# EAGLE schematic Power_section (EAGLE 7.3.0)
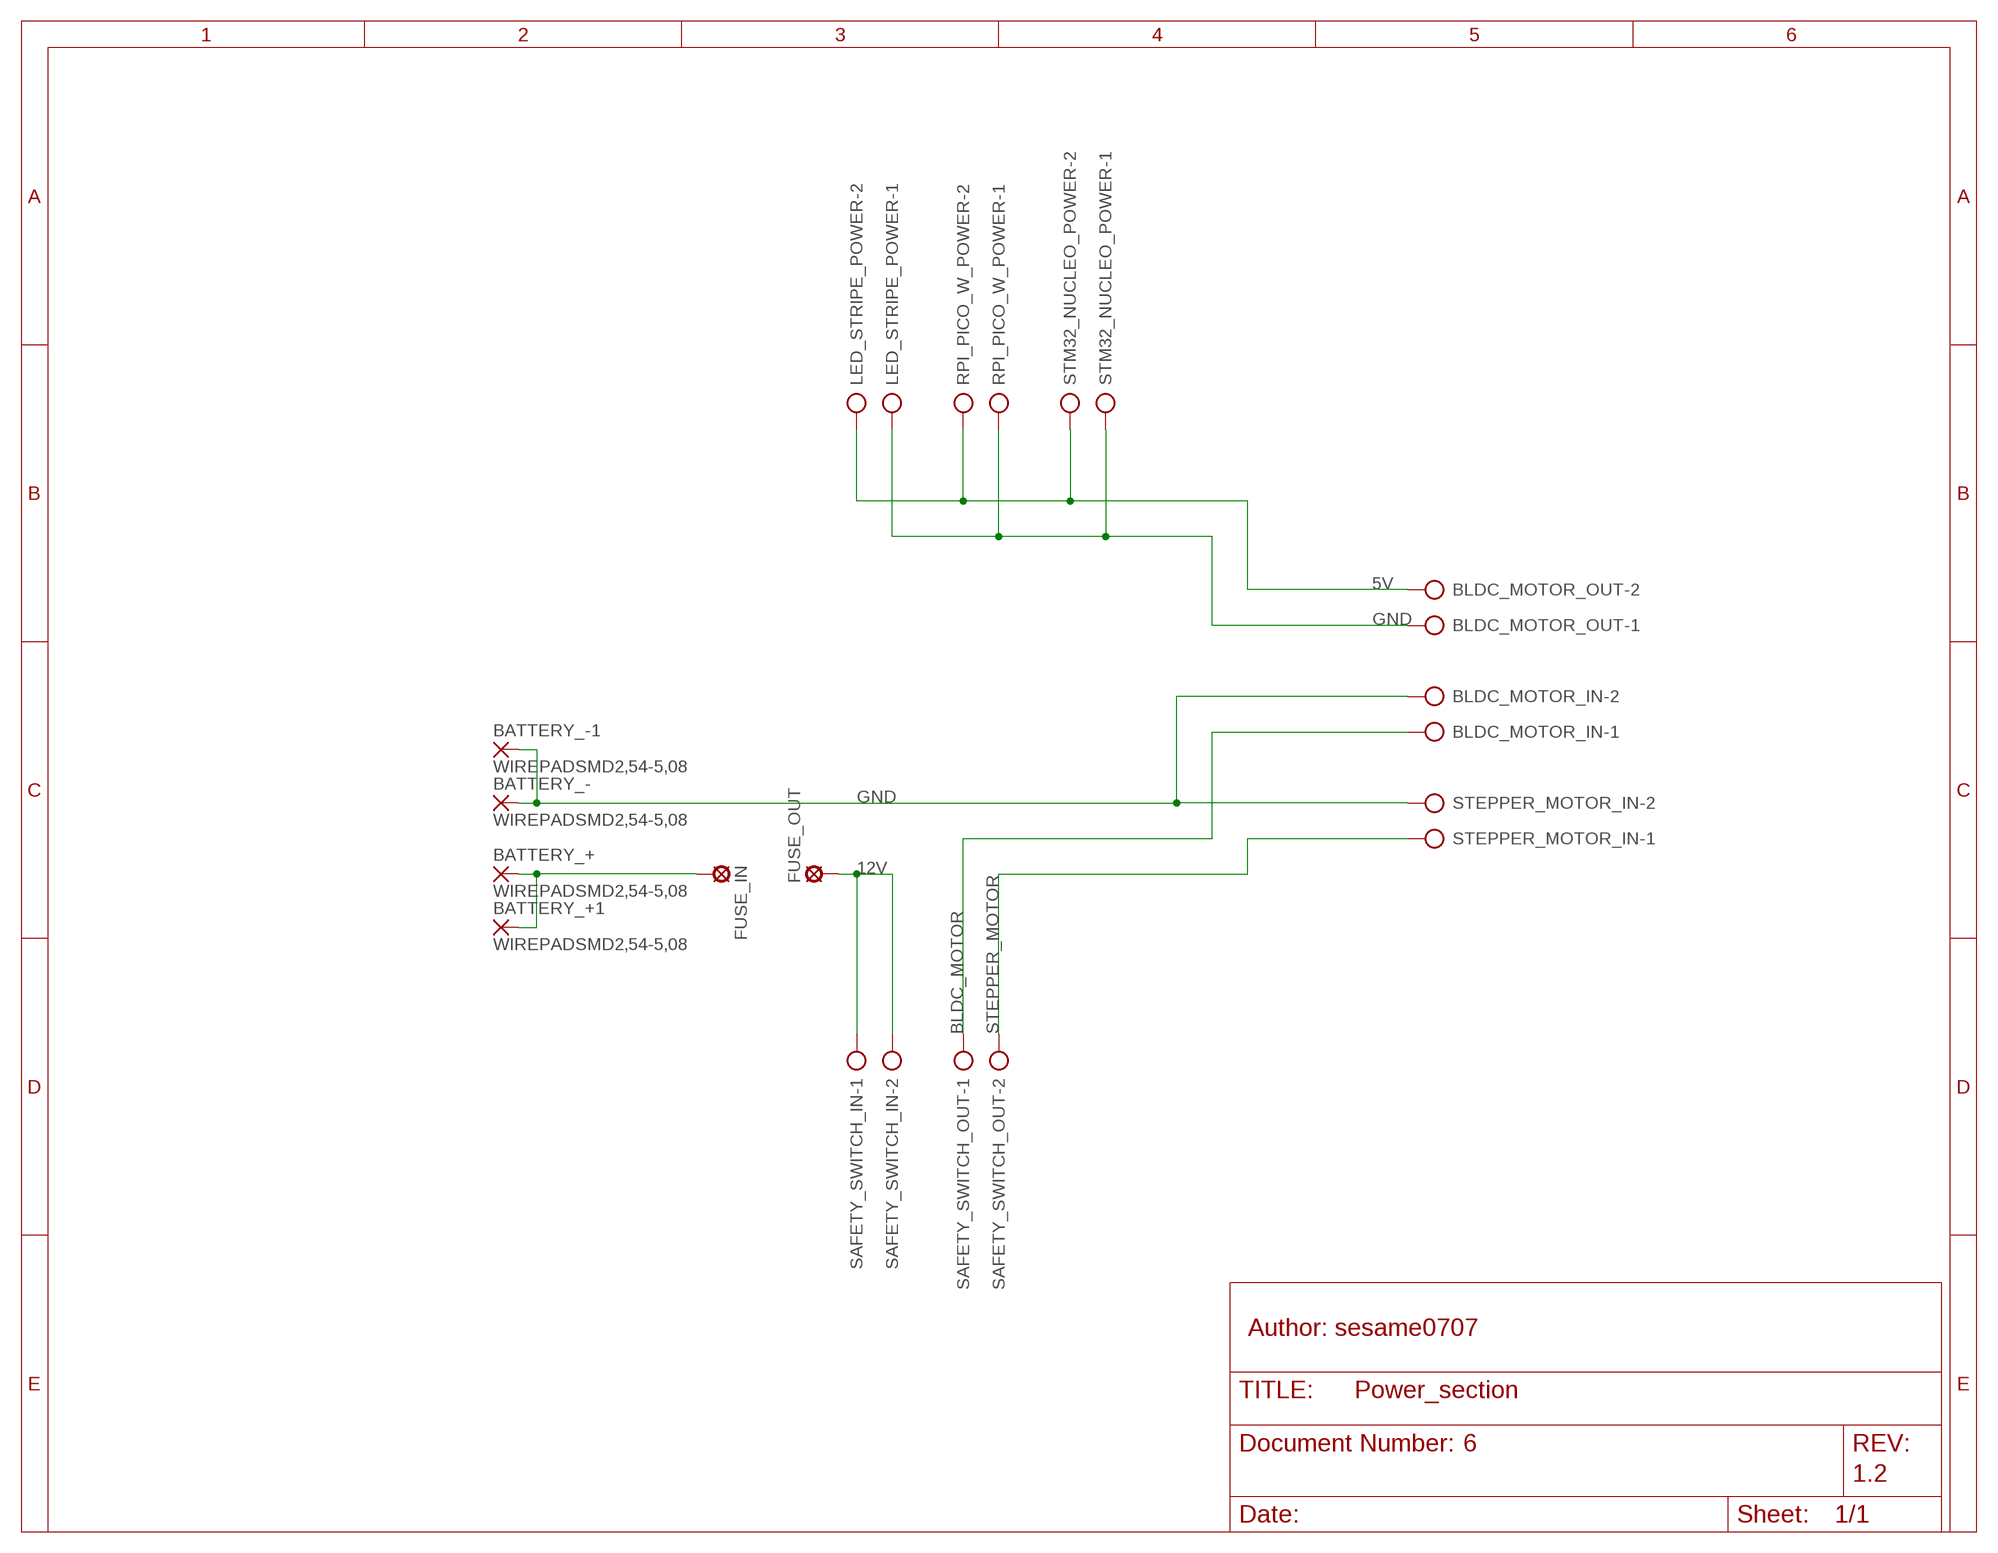
[diagram p0: schematic, sheet 1]

## Parts
BATTERY_+  WIREPADSMD2,54-5,08  [SMD2,54-5,08]
BATTERY_+1  WIREPADSMD2,54-5,08  [SMD2,54-5,08]
BATTERY_-  WIREPADSMD2,54-5,08  [SMD2,54-5,08]
BATTERY_-1  WIREPADSMD2,54-5,08  [SMD2,54-5,08]
BLDC_MOTOR_IN  AK500/2  [AK500/2]
BLDC_MOTOR_OUT  AK500/2  [AK500/2]
FUSE_IN  SE14  [SE14]
FUSE_OUT  SE14  [SE14]
LED_STRIPE_POWER  AK500/2  [AK500/2]
RPI_PICO_W_POWER  AK500/2  [AK500/2]
SAFETY_SWITCH_IN  AK500/2  [AK500/2]
SAFETY_SWITCH_OUT  AK500/2  [AK500/2]
STEPPER_MOTOR_IN  AK500/2  [AK500/2]
STM32_NUCLEO_POWER  AK500/2  [AK500/2]

## Nets
5V: BLDC_MOTOR_OUT.2 LED_STRIPE_POWER.2 RPI_PICO_W_POWER.2 STM32_NUCLEO_POWER.2
12V: FUSE_OUT.MP SAFETY_SWITCH_IN.1 SAFETY_SWITCH_IN.2
BLDC_MOTOR: BLDC_MOTOR_IN.1 SAFETY_SWITCH_OUT.1
GND: BATTERY_-1.1(P) BATTERY_-.1(P) BLDC_MOTOR_IN.2 BLDC_MOTOR_OUT.1 LED_STRIPE_POWER.1 RPI_PICO_W_POWER.1 STEPPER_MOTOR_IN.2 STM32_NUCLEO_POWER.1
N$1: BATTERY_+1.1(P) BATTERY_+.1(P) FUSE_IN.MP
STEPPER_MOTOR: SAFETY_SWITCH_OUT.2 STEPPER_MOTOR_IN.1

## Notes on the sheet
- Author: sesame0707
- 6
- 1.2

## Library data of the parts
BATTERY_+ BATTERY_+1 BATTERY_- BATTERY_-1 = wirepad:WIREPAD: Wire PAD connect wire on PCB
BLDC_MOTOR_IN BLDC_MOTOR_OUT LED_STRIPE_POWER RPI_PICO_W_POWER SAFETY_SWITCH_IN SAFETY_SWITCH_OUT STEPPER_MOTOR_IN STM32_NUCLEO_POWER = con-ptr500:AK500/2: CONNECTOR; OC_FARNELL: unknown; OC_NEWARK: unknown
FUSE_IN FUSE_OUT = solpad:SE14: SOLDER PAD E1553, drill 1,4mm, distributor Buerklin, 07F820